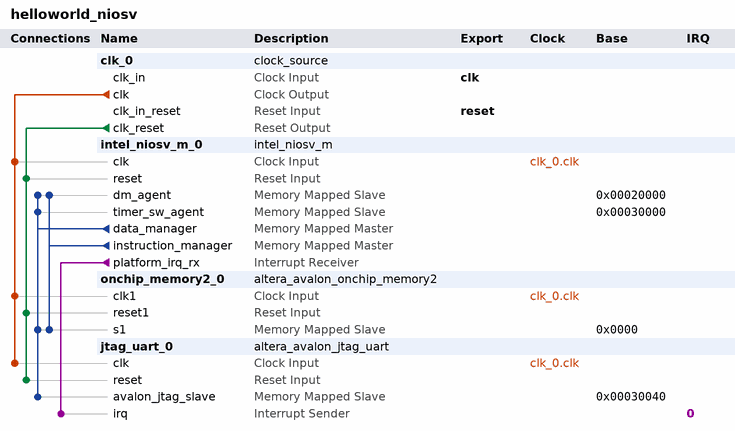
[diagram p0: system contents]
# Platform Designer (Qsys) system helloworld_niosv, Cyclone V 5CSEMA5F31C6
# Parameters at their usual value, and those the tool derives, are not listed.
package require -exact qsys 23.1
create_system helloworld_niosv
set_project_property DEVICE_FAMILY {Cyclone V}
set_project_property DEVICE 5CSEMA5F31C6

add_instance clk_0 clock_source 23.1
set_instance_parameter_value clk_0 clockFrequency 50000000

add_instance intel_niosv_m_0 intel_niosv_m 2.0.0
set_instance_parameter_value intel_niosv_m_0 enableDebugReset false
set_instance_parameter_value intel_niosv_m_0 enableECCLite false
set_instance_parameter_value intel_niosv_m_0 pipelineArch true
set_instance_parameter_value intel_niosv_m_0 resetSlave onchip_memory2_0.s1

add_instance onchip_memory2_0 altera_avalon_onchip_memory2 23.1
set_instance_parameter_value onchip_memory2_0 dataWidth 32
set_instance_parameter_value onchip_memory2_0 dualPort false
set_instance_parameter_value onchip_memory2_0 initMemContent true
set_instance_parameter_value onchip_memory2_0 initializationFileName onchip_mem.hex
set_instance_parameter_value onchip_memory2_0 memorySize 131072

add_instance jtag_uart_0 altera_avalon_jtag_uart 23.1
set_instance_parameter_value jtag_uart_0 simInteractiveOptions NO_INTERACTIVE_WINDOWS

# connections
add_connection clk_0.clk intel_niosv_m_0.clk clock
add_connection clk_0.clk jtag_uart_0.clk clock
add_connection clk_0.clk onchip_memory2_0.clk1 clock
add_connection clk_0.clk_reset intel_niosv_m_0.reset reset
add_connection clk_0.clk_reset jtag_uart_0.reset reset
add_connection clk_0.clk_reset onchip_memory2_0.reset1 reset
add_connection intel_niosv_m_0.data_manager intel_niosv_m_0.dm_agent avalon
set_connection_parameter_value intel_niosv_m_0.data_manager/intel_niosv_m_0.dm_agent baseAddress 0x00020000
add_connection intel_niosv_m_0.data_manager intel_niosv_m_0.timer_sw_agent avalon
set_connection_parameter_value intel_niosv_m_0.data_manager/intel_niosv_m_0.timer_sw_agent baseAddress 0x00030000
add_connection intel_niosv_m_0.data_manager jtag_uart_0.avalon_jtag_slave avalon
set_connection_parameter_value intel_niosv_m_0.data_manager/jtag_uart_0.avalon_jtag_slave baseAddress 0x00030040
add_connection intel_niosv_m_0.data_manager onchip_memory2_0.s1 avalon
set_connection_parameter_value intel_niosv_m_0.data_manager/onchip_memory2_0.s1 baseAddress 0x0000
add_connection intel_niosv_m_0.instruction_manager intel_niosv_m_0.dm_agent avalon
set_connection_parameter_value intel_niosv_m_0.instruction_manager/intel_niosv_m_0.dm_agent baseAddress 0x00020000
add_connection intel_niosv_m_0.instruction_manager onchip_memory2_0.s1 avalon
set_connection_parameter_value intel_niosv_m_0.instruction_manager/onchip_memory2_0.s1 baseAddress 0x0000
add_connection intel_niosv_m_0.platform_irq_rx jtag_uart_0.irq interrupt
set_connection_parameter_value intel_niosv_m_0.platform_irq_rx/jtag_uart_0.irq irqNumber 0

# exported interfaces
add_interface clk clock sink
set_interface_property clk EXPORT_OF clk_0.clk_in
add_interface reset reset sink
set_interface_property reset EXPORT_OF clk_0.clk_in_reset

set_interconnect_requirement {$system} qsys_mm.clockCrossingAdapter HANDSHAKE
set_interconnect_requirement {$system} qsys_mm.enableEccProtection FALSE
set_interconnect_requirement {$system} qsys_mm.insertDefaultSlave FALSE
set_interconnect_requirement {$system} qsys_mm.maxAdditionalLatency 1

save_system helloworld_niosv.qsys
